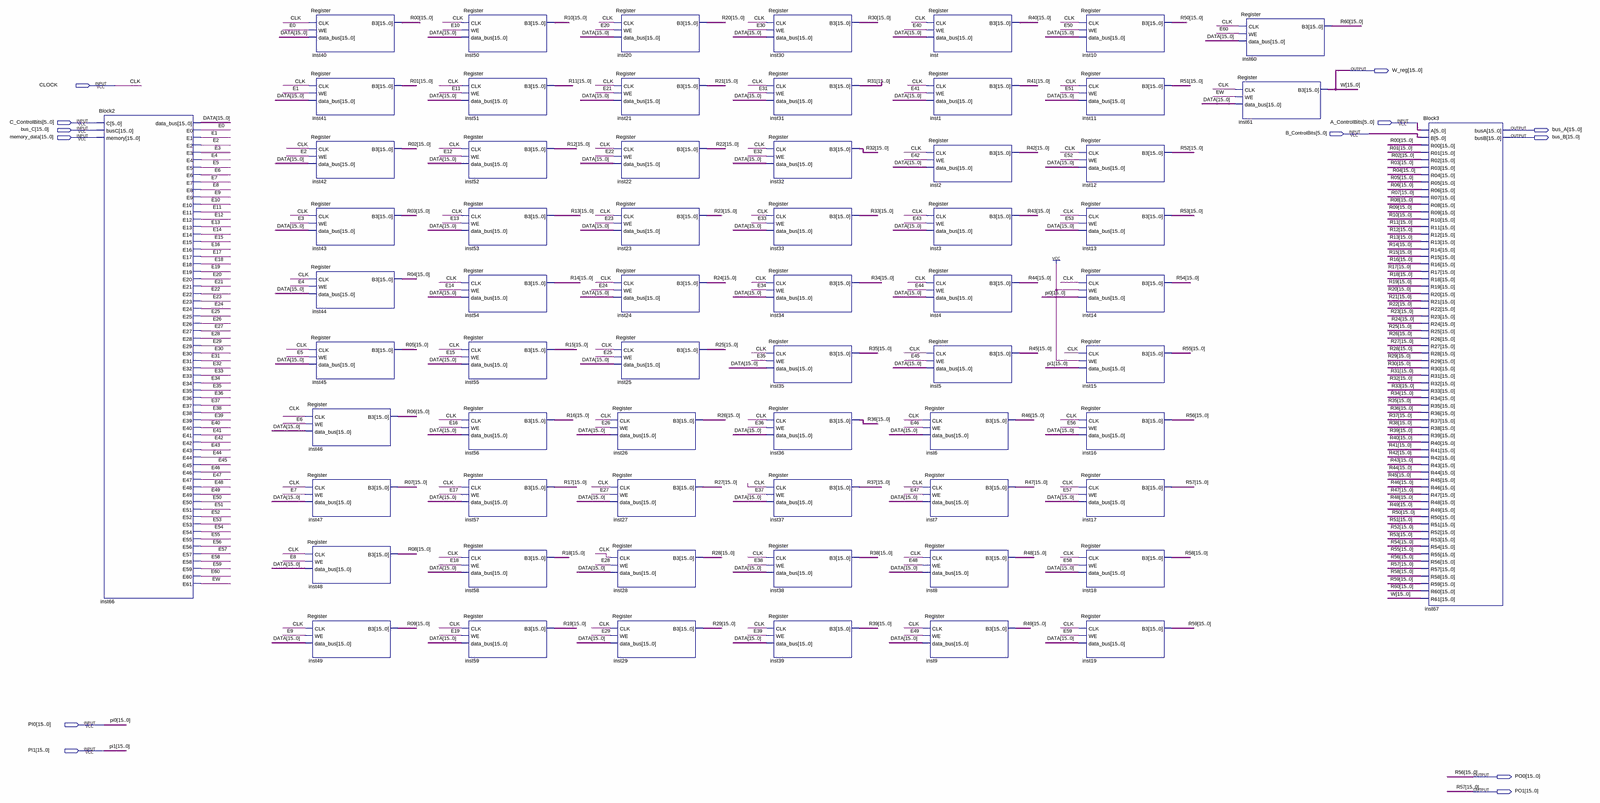
[diagram p0: schematic sheet, whole]
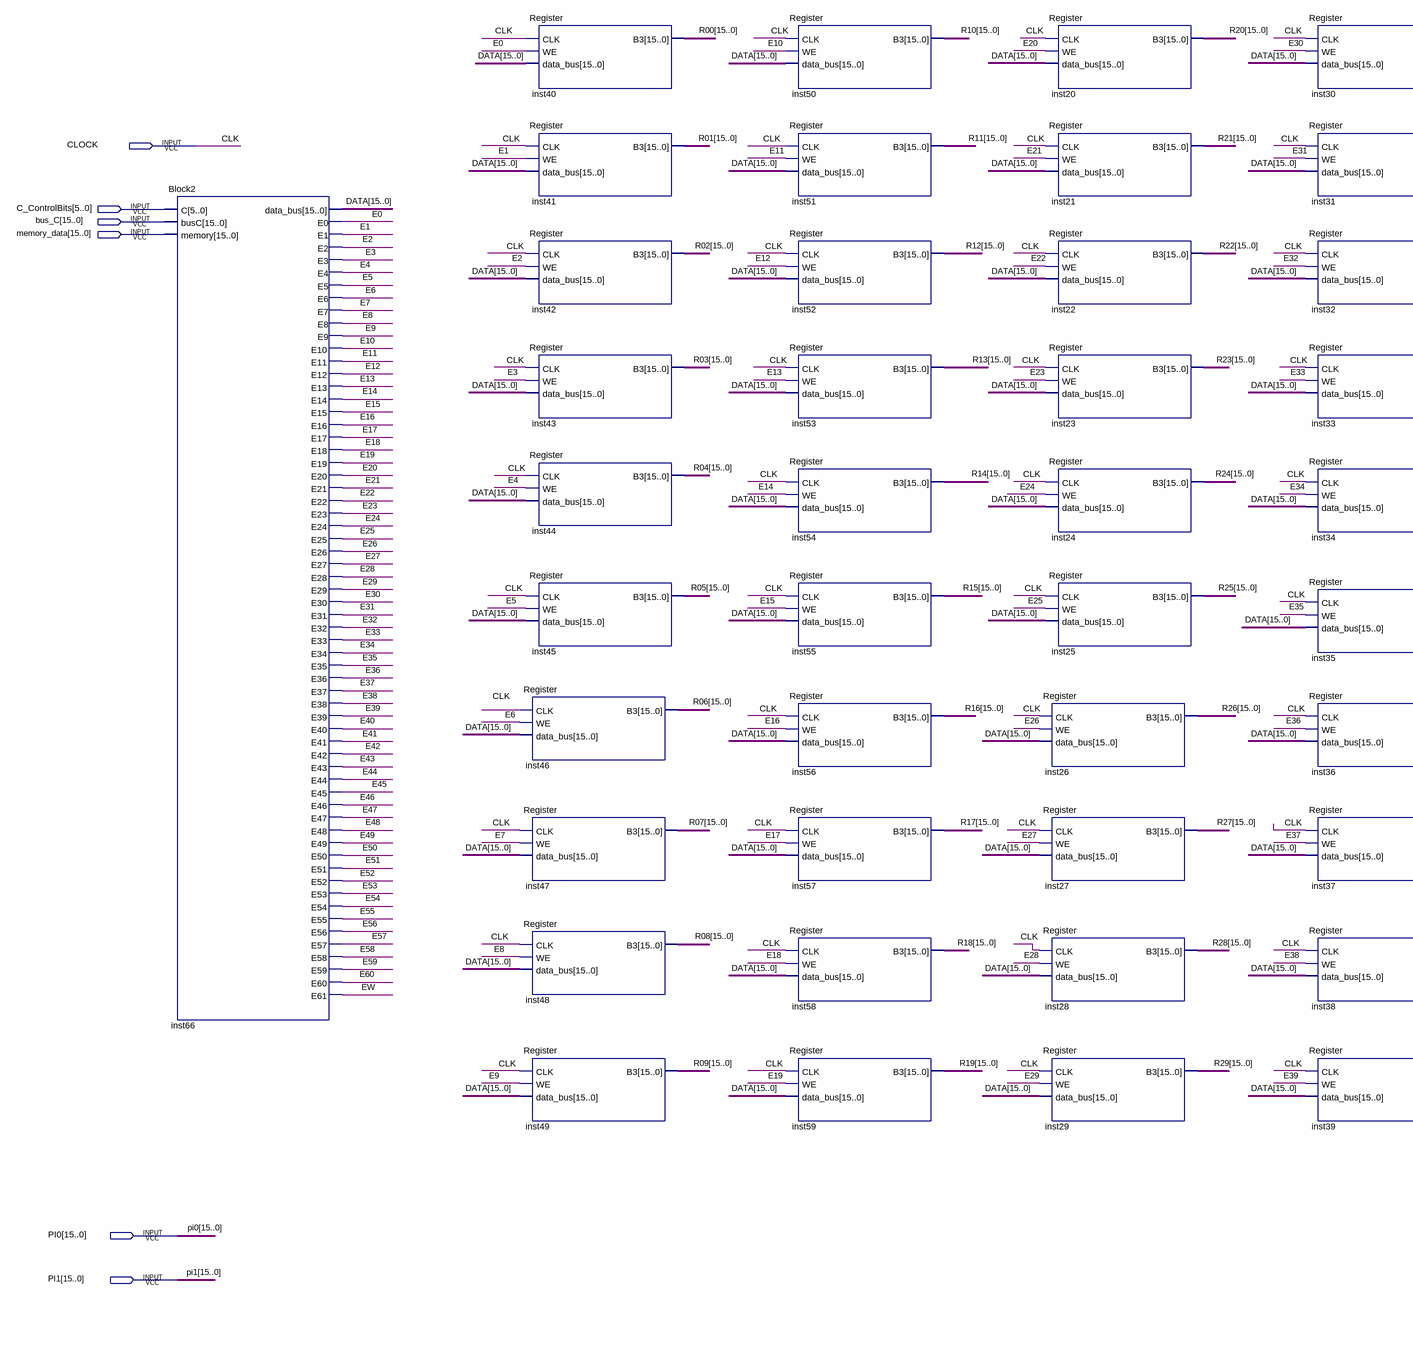
[diagram p1: schematic sheet, left part]
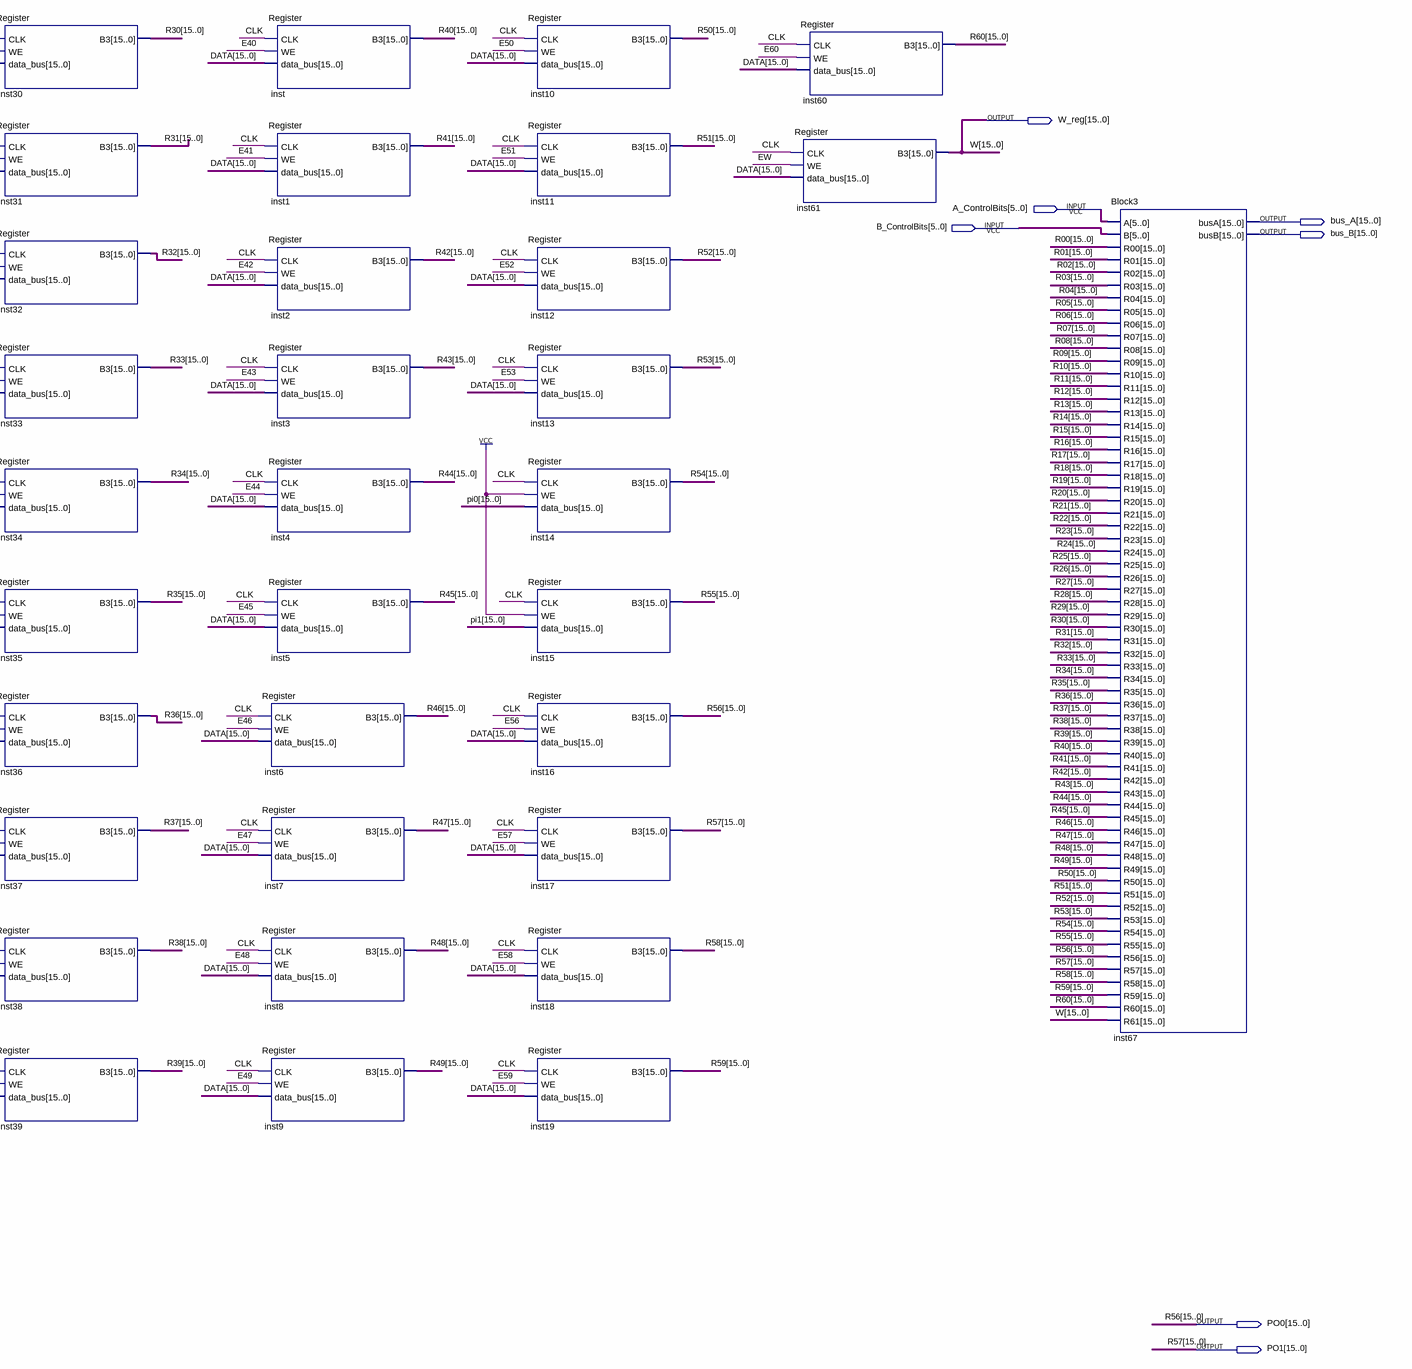
[diagram p2: schematic sheet, right part]
// Quartus schematic RegisterBank.bdf as structural Verilog: 64 symbols, 13 pins
module RegisterBank (
  input  CLOCK,
  input  [5:0] C_ControlBits,
  input  [5:0] A_ControlBits,
  input  [15:0] bus_C,
  input  [5:0] B_ControlBits,
  input  [15:0] memory_data,
  input  [15:0] PI0,
  input  [15:0] PI1,
  output [15:0] W_reg,
  output [15:0] bus_A,
  output [15:0] bus_B,
  output [15:0] PO0,
  output [15:0] PO1
);

  wire E0, E1, E2, E3, E4, E5, E6, E7, E8, E9, E10, E11, E12, E13, E14, E15, E16, E17, E18, E19, E20, E21,
       E22, E23, E24, E25, E26, E27, E28, E29, E30, E31, E32, E33, E34, E35, E36, E37, E38, E39, E40, E41,
       E42, E43, E44, E45, E46, E47, E48, E49, E50, E51, E52, E53, E54, E55, E56, E57, E58, E59, E60, EW;
  wire [15:0] DATA, R00, R01, R02, R03, R04, R05, R06, R07, R08, R09, R10, R11, R12, R13, R14, R15, R16, R17,
       R18, R19, R20, R21, R22, R23, R24, R25, R26, R27, R28, R29, R30, R31, R32, R33, R34, R35, R36, R37,
       R38, R39, R40, R41, R42, R43, R44, R45, R46, R47, R48, R49, R50, R51, R52, R53, R54, R55, R58, R59,
       R60;

  Block2 inst66 (
    .C(C_ControlBits), .busC(bus_C), .memory(memory_data), .data_bus(DATA), .E0(E0), .E1(E1), .E2(E2),
    .E3(E3), .E4(E4), .E5(E5), .E6(E6), .E7(E7), .E8(E8), .E9(E9), .E10(E10), .E11(E11), .E12(E12),
    .E13(E13), .E14(E14), .E15(E15), .E16(E16), .E17(E17), .E18(E18), .E19(E19), .E20(E20), .E21(E21),
    .E22(E22), .E23(E23), .E24(E24), .E25(E25), .E26(E26), .E27(E27), .E28(E28), .E29(E29), .E30(E30),
    .E31(E31), .E32(E32), .E33(E33), .E34(E34), .E35(E35), .E36(E36), .E37(E37), .E38(E38), .E39(E39),
    .E40(E40), .E41(E41), .E42(E42), .E43(E43), .E44(E44), .E45(E45), .E46(E46), .E47(E47), .E48(E48),
    .E49(E49), .E50(E50), .E51(E51), .E52(E52), .E53(E53), .E54(E54), .E55(E55), .E56(E56), .E57(E57),
    .E58(E58), .E59(E59), .E60(E60), .E61(EW));
  Register inst40 (.CLK(CLOCK), .WE(E0), .data_bus(DATA), .B3(R00));
  Register inst41 (.CLK(CLOCK), .WE(E1), .data_bus(DATA), .B3(R01));
  Register inst42 (.CLK(CLOCK), .WE(E2), .data_bus(DATA), .B3(R02));
  Register inst43 (.CLK(CLOCK), .WE(E3), .data_bus(DATA), .B3(R03));
  Register inst44 (.CLK(CLOCK), .WE(E4), .data_bus(DATA), .B3(R04));
  Register inst45 (.CLK(CLOCK), .WE(E5), .data_bus(DATA), .B3(R05));
  Register inst46 (.CLK(CLOCK), .WE(E6), .data_bus(DATA), .B3(R06));
  Register inst47 (.CLK(CLOCK), .WE(E7), .data_bus(DATA), .B3(R07));
  Register inst48 (.CLK(CLOCK), .WE(E8), .data_bus(DATA), .B3(R08));
  Register inst49 (.CLK(CLOCK), .WE(E9), .data_bus(DATA), .B3(R09));
  Register inst50 (.CLK(CLOCK), .WE(E10), .data_bus(DATA), .B3(R10));
  Register inst51 (.CLK(CLOCK), .WE(E11), .data_bus(DATA), .B3(R11));
  Register inst52 (.CLK(CLOCK), .WE(E12), .data_bus(DATA), .B3(R12));
  Register inst53 (.CLK(CLOCK), .WE(E13), .data_bus(DATA), .B3(R13));
  Register inst54 (.CLK(CLOCK), .WE(E14), .data_bus(DATA), .B3(R14));
  Register inst55 (.CLK(CLOCK), .WE(E15), .data_bus(DATA), .B3(R15));
  Register inst56 (.CLK(CLOCK), .WE(E16), .data_bus(DATA), .B3(R16));
  Register inst57 (.CLK(CLOCK), .WE(E17), .data_bus(DATA), .B3(R17));
  Register inst58 (.CLK(CLOCK), .WE(E18), .data_bus(DATA), .B3(R18));
  Register inst59 (.CLK(CLOCK), .WE(E19), .data_bus(DATA), .B3(R19));
  Register inst20 (.CLK(CLOCK), .WE(E20), .data_bus(DATA), .B3(R20));
  Register inst21 (.CLK(CLOCK), .WE(E21), .data_bus(DATA), .B3(R21));
  Register inst22 (.CLK(CLOCK), .WE(E22), .data_bus(DATA), .B3(R22));
  Register inst23 (.CLK(CLOCK), .WE(E23), .data_bus(DATA), .B3(R23));
  Register inst24 (.CLK(CLOCK), .WE(E24), .data_bus(DATA), .B3(R24));
  Register inst25 (.CLK(CLOCK), .WE(E25), .data_bus(DATA), .B3(R25));
  Register inst26 (.CLK(CLOCK), .WE(E26), .data_bus(DATA), .B3(R26));
  Register inst27 (.CLK(CLOCK), .WE(E27), .data_bus(DATA), .B3(R27));
  Register inst28 (.CLK(CLOCK), .WE(E28), .data_bus(DATA), .B3(R28));
  Register inst29 (.CLK(CLOCK), .WE(E29), .data_bus(DATA), .B3(R29));
  Register inst30 (.CLK(CLOCK), .WE(E30), .data_bus(DATA), .B3(R30));
  Register inst31 (.CLK(CLOCK), .WE(E31), .data_bus(DATA), .B3(R31));
  Register inst32 (.CLK(CLOCK), .WE(E32), .data_bus(DATA), .B3(R32));
  Register inst33 (.CLK(CLOCK), .WE(E33), .data_bus(DATA), .B3(R33));
  Register inst34 (.CLK(CLOCK), .WE(E34), .data_bus(DATA), .B3(R34));
  Register inst35 (.CLK(CLOCK), .WE(E35), .data_bus(DATA), .B3(R35));
  Register inst36 (.CLK(CLOCK), .WE(E36), .data_bus(DATA), .B3(R36));
  Register inst37 (.CLK(CLOCK), .WE(E37), .data_bus(DATA), .B3(R37));
  Register inst38 (.CLK(CLOCK), .WE(E38), .data_bus(DATA), .B3(R38));
  Register inst39 (.CLK(CLOCK), .WE(E39), .data_bus(DATA), .B3(R39));
  Register inst (.CLK(CLOCK), .WE(E40), .data_bus(DATA), .B3(R40));
  Register inst1 (.CLK(CLOCK), .WE(E41), .data_bus(DATA), .B3(R41));
  Register inst2 (.CLK(CLOCK), .WE(E42), .data_bus(DATA), .B3(R42));
  Register inst3 (.CLK(CLOCK), .WE(E43), .data_bus(DATA), .B3(R43));
  Register inst4 (.CLK(CLOCK), .WE(E44), .data_bus(DATA), .B3(R44));
  Register inst5 (.CLK(CLOCK), .WE(E45), .data_bus(DATA), .B3(R45));
  Register inst6 (.CLK(CLOCK), .WE(E46), .data_bus(DATA), .B3(R46));
  Register inst7 (.CLK(CLOCK), .WE(E47), .data_bus(DATA), .B3(R47));
  Register inst8 (.CLK(CLOCK), .WE(E48), .data_bus(DATA), .B3(R48));
  Register inst9 (.CLK(CLOCK), .WE(E49), .data_bus(DATA), .B3(R49));
  Register inst10 (.CLK(CLOCK), .WE(E50), .data_bus(DATA), .B3(R50));
  Register inst11 (.CLK(CLOCK), .WE(E51), .data_bus(DATA), .B3(R51));
  Register inst12 (.CLK(CLOCK), .WE(E52), .data_bus(DATA), .B3(R52));
  Register inst13 (.CLK(CLOCK), .WE(E53), .data_bus(DATA), .B3(R53));
  Register inst14 (.CLK(CLOCK), .WE(1'b1), .data_bus(PI0), .B3(R54));
  Register inst15 (.CLK(CLOCK), .WE(1'b1), .data_bus(PI1), .B3(R55));
  Register inst16 (.CLK(CLOCK), .WE(E56), .data_bus(DATA), .B3(PO0));
  Register inst17 (.CLK(CLOCK), .WE(E57), .data_bus(DATA), .B3(PO1));
  Register inst18 (.CLK(CLOCK), .WE(E58), .data_bus(DATA), .B3(R58));
  Register inst19 (.CLK(CLOCK), .WE(E59), .data_bus(DATA), .B3(R59));
  Register inst60 (.CLK(CLOCK), .WE(E60), .data_bus(DATA), .B3(R60));
  Register inst61 (.CLK(CLOCK), .WE(EW), .data_bus(DATA), .B3(W_reg));
  Block3 inst67 (
    .A(A_ControlBits), .B(B_ControlBits), .R00(R00), .R01(R01), .R02(R02), .R03(R03), .R04(R04), .R05(R05),
    .R06(R06), .R07(R07), .R08(R08), .R09(R09), .R10(R10), .R11(R11), .R12(R12), .R13(R13), .R14(R14),
    .R15(R15), .R16(R16), .R17(R17), .R18(R18), .R19(R19), .R20(R20), .R21(R21), .R22(R22), .R23(R23),
    .R24(R24), .R25(R25), .R26(R26), .R27(R27), .R28(R28), .R29(R29), .R30(R30), .R31(R31), .R32(R32),
    .R33(R33), .R34(R34), .R35(R35), .R36(R36), .R37(R37), .R38(R38), .R39(R39), .R40(R40), .R41(R41),
    .R42(R42), .R43(R43), .R44(R44), .R45(R45), .R46(R46), .R47(R47), .R48(R48), .R49(R49), .R50(R50),
    .R51(R51), .R52(R52), .R53(R53), .R54(R54), .R55(R55), .R56(PO0), .R57(PO1), .R58(R58), .R59(R59),
    .R60(R60), .R61(W_reg), .busA(bus_A), .busB(bus_B));

  // Other names for the same wires on the sheet: CLK = CLOCK; R56[15:0] = PO0; R57[15:0] = PO1; W[15:0] = W_reg
endmodule
